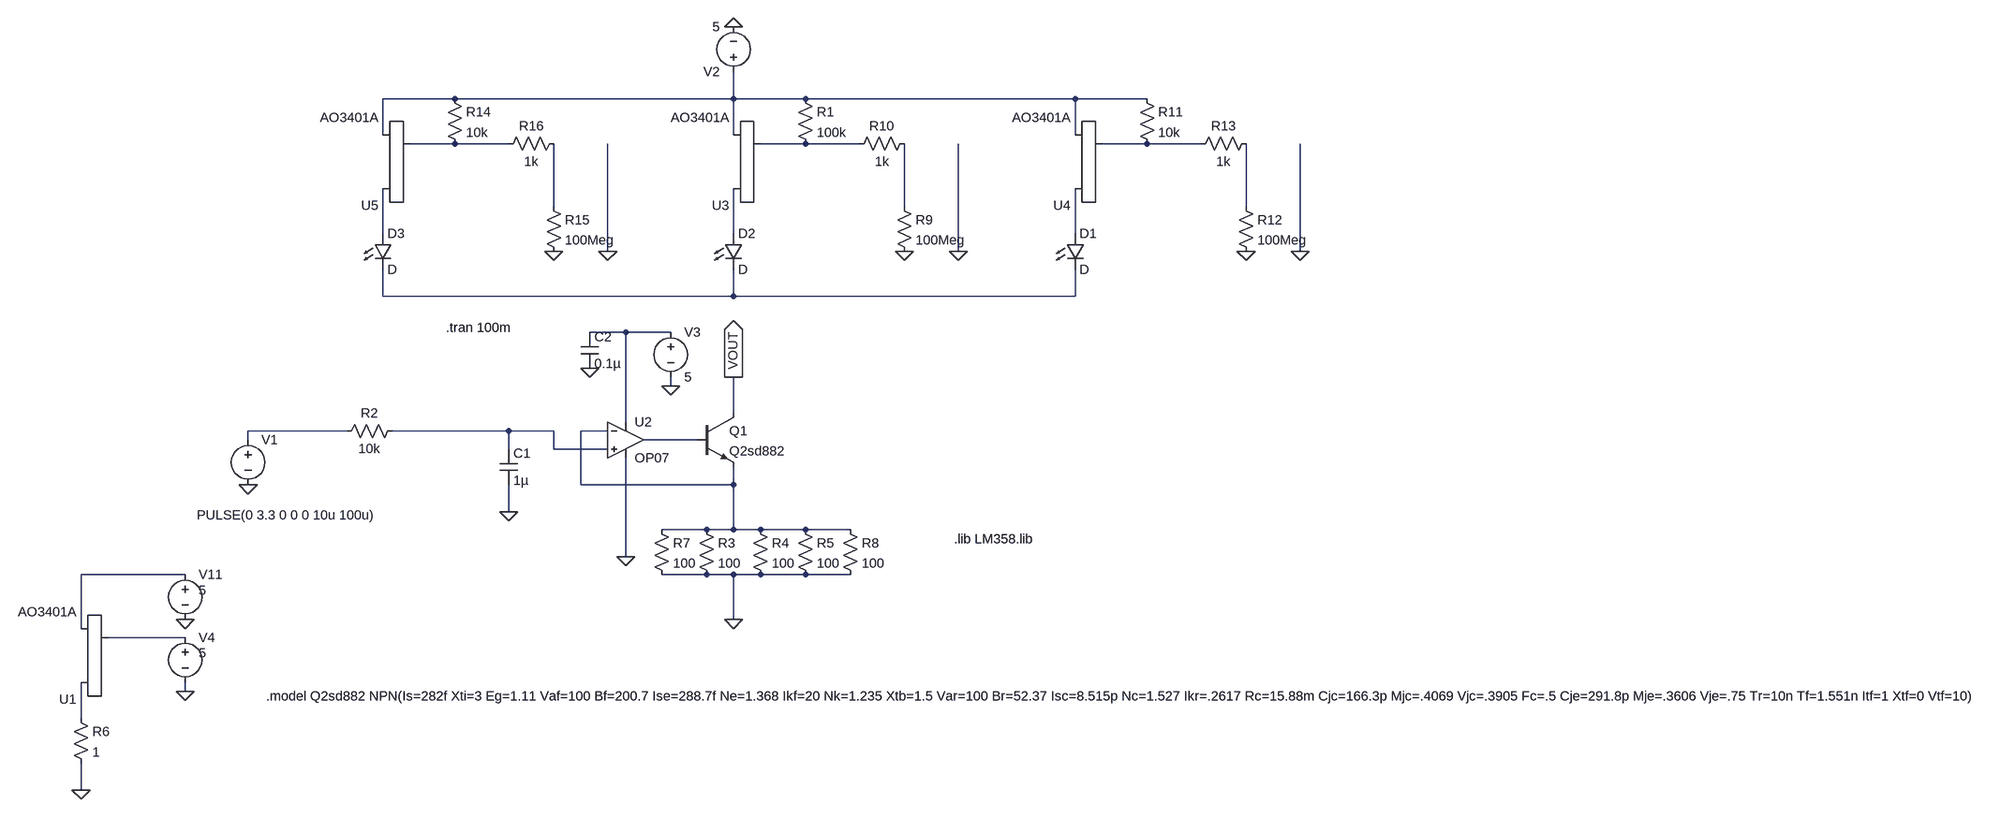
[diagram p0: schematic Led Driver.asc]
Led Driver.asc, the LTspice schematic file:
Version 4
SHEET 1 2928 740
WIRE -128 -512 -256 -512
WIRE 368 -512 368 -560
WIRE 368 -512 -128 -512
WIRE 496 -512 368 -512
WIRE 976 -512 496 -512
WIRE 1104 -512 976 -512
WIRE -256 -448 -256 -512
WIRE 368 -448 368 -512
WIRE 976 -448 976 -512
WIRE -128 -432 -208 -432
WIRE -32 -432 -128 -432
WIRE 496 -432 416 -432
WIRE 592 -432 496 -432
WIRE 1104 -432 1024 -432
WIRE 1200 -432 1104 -432
WIRE 48 -320 48 -432
WIRE 672 -320 672 -432
WIRE 1280 -320 1280 -432
WIRE -256 -272 -256 -352
WIRE 368 -272 368 -352
WIRE 976 -272 976 -352
WIRE 144 -240 144 -432
WIRE 768 -240 768 -432
WIRE 1376 -240 1376 -432
WIRE -256 -160 -256 -208
WIRE 368 -160 368 -208
WIRE 368 -160 -256 -160
WIRE 976 -160 976 -208
WIRE 976 -160 368 -160
WIRE 176 -96 112 -96
WIRE 256 -96 176 -96
WIRE 256 0 256 -16
WIRE 368 48 368 -16
WIRE 176 64 176 -96
WIRE -320 80 -496 80
WIRE -32 80 -240 80
WIRE 48 80 -32 80
WIRE 144 80 96 80
WIRE -496 96 -496 80
WIRE 304 96 208 96
WIRE -32 112 -32 80
WIRE 48 112 48 80
WIRE 144 112 48 112
WIRE 96 176 96 80
WIRE 368 176 368 144
WIRE 368 176 96 176
WIRE -32 224 -32 176
WIRE 320 256 240 256
WIRE 368 256 368 176
WIRE 368 256 320 256
WIRE 416 256 368 256
WIRE 496 256 416 256
WIRE 576 256 496 256
WIRE 176 304 176 128
WIRE -608 336 -800 336
WIRE 320 336 240 336
WIRE 368 336 320 336
WIRE 416 336 368 336
WIRE 496 336 416 336
WIRE 576 336 496 336
WIRE 368 416 368 336
WIRE -800 432 -800 336
WIRE -608 448 -752 448
WIRE -608 544 -608 528
WIRE -800 592 -800 528
WIRE -800 720 -800 672
FLAG 176 304 0
FLAG 256 0 0
FLAG 368 -640 0
FLAG -496 176 0
FLAG -32 224 0
FLAG 368 -16 VOUT
IOPIN 368 -16 Out
FLAG 768 -240 0
FLAG 368 416 0
FLAG -800 720 0
FLAG -608 544 0
FLAG -608 416 0
FLAG 672 -240 0
FLAG 1376 -240 0
FLAG 1280 -240 0
FLAG 144 -240 0
FLAG 48 -240 0
FLAG 112 -32 0
SYMBOL cap -48 112 R0
SYMATTR InstName C1
SYMATTR Value 1µ
SYMBOL voltage -496 80 R0
WINDOW 3 -91 150 Left 2
WINDOW 123 0 0 Left 0
WINDOW 39 0 0 Left 0
SYMATTR Value PULSE(0 3.3 0 0 0 10u 100u)
SYMATTR InstName V1
SYMBOL npn 304 48 R0
SYMATTR InstName Q1
SYMATTR Value Q2sd882
SYMBOL voltage 368 -544 R180
WINDOW 123 0 0 Left 0
WINDOW 39 0 0 Left 0
SYMATTR InstName V2
SYMATTR Value 5
SYMBOL voltage 256 -112 R0
WINDOW 123 0 0 Left 0
WINDOW 39 0 0 Left 0
SYMATTR InstName V3
SYMATTR Value 5
SYMBOL res -224 64 R90
WINDOW 0 0 56 VBottom 2
WINDOW 3 32 56 VTop 2
SYMATTR InstName R2
SYMATTR Value 10k
SYMBOL LED 352 -272 R0
SYMATTR InstName D2
SYMBOL res 480 -528 R0
SYMATTR InstName R1
SYMATTR Value 100k
SYMBOL voltage -608 432 R0
WINDOW 3 24 44 Left 2
WINDOW 123 0 0 Left 0
WINDOW 39 0 0 Left 0
SYMATTR Value 5
SYMATTR InstName V4
SYMBOL voltage -608 320 R0
WINDOW 3 24 44 Left 2
WINDOW 123 0 0 Left 0
WINDOW 39 0 0 Left 0
SYMATTR Value 5
SYMATTR InstName V11
SYMBOL AO3401A -832 496 R180
SYMATTR InstName U1
SYMBOL res -816 576 R0
SYMATTR InstName R6
SYMATTR Value 1
SYMBOL AO3401A 336 -384 R180
SYMATTR InstName U3
SYMBOL res 304 240 R0
SYMATTR InstName R3
SYMATTR Value 100
SYMBOL res 400 240 R0
SYMATTR InstName R4
SYMATTR Value 100
SYMBOL res 480 240 R0
SYMATTR InstName R5
SYMATTR Value 100
SYMBOL res 224 240 R0
SYMATTR InstName R7
SYMATTR Value 100
SYMBOL OpAmps\\OP07 176 32 R0
SYMATTR InstName U2
SYMBOL res 656 -336 R0
SYMATTR InstName R9
SYMATTR Value 100Meg
SYMBOL res 688 -448 R90
WINDOW 0 0 56 VBottom 2
WINDOW 3 32 56 VTop 2
SYMATTR InstName R10
SYMATTR Value 1k
SYMBOL LED 960 -272 R0
SYMATTR InstName D1
SYMBOL res 1088 -528 R0
SYMATTR InstName R11
SYMATTR Value 10k
SYMBOL AO3401A 944 -384 R180
SYMATTR InstName U4
SYMBOL res 1264 -336 R0
SYMATTR InstName R12
SYMATTR Value 100Meg
SYMBOL res 1296 -448 R90
WINDOW 0 0 56 VBottom 2
WINDOW 3 32 56 VTop 2
SYMATTR InstName R13
SYMATTR Value 1k
SYMBOL LED -272 -272 R0
SYMATTR InstName D3
SYMBOL res -144 -528 R0
SYMATTR InstName R14
SYMATTR Value 10k
SYMBOL AO3401A -288 -384 R180
SYMATTR InstName U5
SYMBOL res 32 -336 R0
SYMATTR InstName R15
SYMATTR Value 100Meg
SYMBOL res 64 -448 R90
WINDOW 0 0 56 VBottom 2
WINDOW 3 32 56 VTop 2
SYMATTR InstName R16
SYMATTR Value 1k
SYMBOL res 560 240 R0
SYMATTR InstName R8
SYMATTR Value 100
SYMBOL cap 96 -96 R0
SYMATTR InstName C2
SYMATTR Value 0.1µ
TEXT -464 552 Left 2 !.model Q2sd882 NPN(Is=282f Xti=3 Eg=1.11 Vaf=100 Bf=200.7 Ise=288.7f Ne=1.368 Ikf=20 Nk=1.235 Xtb=1.5 Var=100 Br=52.37 Isc=8.515p Nc=1.527 Ikr=.2617 Rc=15.88m Cjc=166.3p Mjc=.4069 Vjc=.3905 Fc=.5 Cje=291.8p Mje=.3606 Vje=.75 Tr=10n Tf=1.551n Itf=1 Xtf=0 Vtf=10)
TEXT 760 272 Left 2 !.lib LM358.lib
TEXT -144 -104 Left 2 !.tran 100m

The netlist it stands for:
* Led Driver.asc
C1 N014 0 1µ
V1 N013 0 PULSE(0 3.3 0 0 0 10u 100u)
Q1 VOUT N016 N015 0 Q2sd882
V2 N001 0 5
V3 N012 0 5
R2 N014 N013 10k
D2 N009 N011 D
R1 N001 N003 100k
V4 N018 0 5
V11 N017 0 5
XU1 N019 N018 N017 AO3401A
R6 N019 0 1
XU3 N009 N003 N001 AO3401A
R3 N015 0 100
R4 N015 0 100
R5 N015 0 100
R7 N015 0 100
XU2 N014 N015 N012 0 N016 LT1001  ; OP07, pins In+ In- V+ V- OUT
R9 N006 0 100Meg
R10 N006 N003 1k
D1 N010 N011 D
R11 N001 N004 10k
XU4 N010 N004 N001 AO3401A
R12 N007 0 100Meg
R13 N007 N004 1k
D3 N008 N011 D
R14 N001 N002 10k
XU5 N008 N002 N001 AO3401A
R15 N005 0 100Meg
R16 N005 N002 1k
R8 N015 0 100
C2 N012 0 0.1µ
.model D D
.lib standard.dio
.model NPN NPN
.model PNP PNP
.lib standard.bjt
.model Q2sd882 NPN(Is=282f Xti=3 Eg=1.11 Vaf=100 Bf=200.7 Ise=288.7f Ne=1.368 Ikf=20 Nk=1.235 Xtb=1.5 Var=100 Br=52.37 Isc=8.515p Nc=1.527 Ikr=.2617 Rc=15.88m Cjc=166.3p Mjc=.4069 Vjc=.3905 Fc=.5 Cje=291.8p Mje=.3606 Vje=.75 Tr=10n Tf=1.551n Itf=1 Xtf=0 Vtf=10)
.lib LM358.lib
.tran 100m
.lib AO3401A.mod
.lib LTC.lib
.backanno
.end